# Altium schematic sheet Top-Sheet.SchDoc
size 420 x 297 mm; SheetNumber: 1; SheetTotal: 3
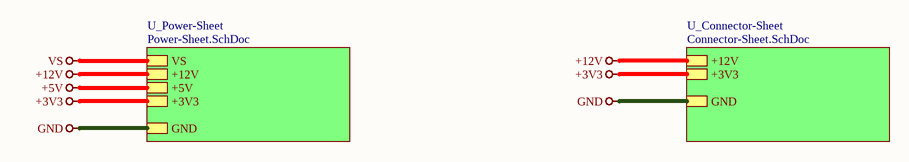
[diagram p0: Top-Sheet.SchDoc]

## Sub-sheets
U_Connector-Sheet = Connector-Sheet.SchDoc: +12V, +3V3, GND
U_Power-Sheet = Power-Sheet.SchDoc: +12V, +5V, +3V3, GND, VS

## Nets
+3V3: sheet U_Connector-Sheet/+3V3, sheet U_Power-Sheet/+3V3
+5V: sheet U_Power-Sheet/+5V
+12V: sheet U_Connector-Sheet/+12V, sheet U_Power-Sheet/+12V
GND: sheet U_Connector-Sheet/GND, sheet U_Power-Sheet/GND
VS: sheet U_Power-Sheet/VS

## Notes on the sheet
- File:
- Title:
- Date:
- Page
- Num:
- Total:
- Drawn By: Huzaifa Ali